# Altium schematic sheet Debug.SchDoc: DEBUG PORT
size A4; SheetNumber: 5; SheetTotal: 5; DOC_NO_SCH_DWG: #022024031004
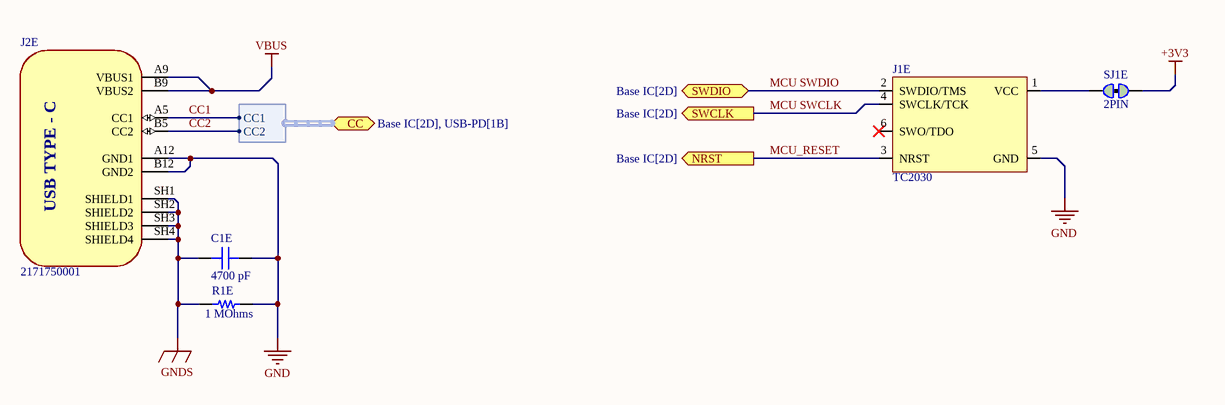
[diagram p0: Debug.SchDoc]

## Parts
C1E  4700 pF  [CAP 0402_1005]
J1E  TC2030  [TC2030-FP]  (no BOM)
J2E  2171750001  [MOLEX_2171750001]
R1E  1 MOhms  [RES 0402_1005]
SJ1E  2PIN  [Rounded Jumper Joint]

## Ports
CC (bidir, harness CC, see Base IC[2D], USB-PD[1B]), NRST (out, see Base IC[2D]), SWCLK (out, see Base IC[2D]), SWDIO (bidir, see Base IC[2D])

## Harnesses
CC: CC1, CC2

## Nets
+3V3: SJ1E.2
GND: C1E.2 J1E.5(GND) J2E.A12(GND1) J2E.B12(GND2) R1E.2
GNDS: C1E.1 J2E.SH1(SHIELD1) J2E.SH2(SHIELD2) J2E.SH3(SHIELD3) J2E.SH4(SHIELD4) R1E.1
VBUS: J2E.A9(VBUS1) J2E.B9(VBUS2)
CC1: J2E.A5(CC1) ; port CC.CC1
CC2: J2E.B5(CC2) ; port CC.CC2
MCU SWCLK: J1E.4(SWCLK/TCK) ; port SWCLK
MCU SWDIO: J1E.2(SWDIO/TMS) ; port SWDIO
MCU_RESET: J1E.3(NRST) ; port NRST
NetJ1E_1: J1E.1(VCC) SJ1E.1

Not connected (* = marked no-connect by the designer): J1E 6(SWO/TDO)*

## Notes on the sheet
- THIS DOCUMENT AND THE DATA DISCLOSED HEREIN OR
- HEREWITH IS THE PROPERTY OF SPD Ind.
- ENG:
- DHARAGESWARAN S
- APPROVALS
- DATE
- PROJECT
- DSN:
- CHK:
- REFERENCE DOCUMENTS
- PROJECT REVISION:
- TITLE
- DOCUMENT REVISION:
- Email: sdhamuvkl@gmail.com <https://github.com/DhamuVkl>
- BOM:
- FAB DWG:
- PCB DWG:
- ASSY DWG:
- SCALE:
- A4
- SIZE
- CAGE CODE
- FILE NAME
- DWG NO.
- SHEET
- REV
- OF
- (in symbol 2171750001) USB TYPE - C

## Library data of the parts
C1E = C0402C472K4RECAUTO: CAP CER 0402 4.7NF 16V X7R 10%; Manufacturer: KEMET; id: 3032; Part Number: C0402C472K4RECAUTO; Value: 4700 pF; Temperature Coefficient: X7R; Supplier Part Number 1: 399-17875-1-ND; ComponentLink2Description: DigiKey Link; ComponentLink1URL: https://api.kemet.com/component-edge/download/datasheet/C0402C472K4RECAUTO.pdf; PartId: 12122; Tolerance: ±10%; Supplier 1: DigiKey; Series: ESD SMD Auto X7R; LastUpdated: 2023-01-03T20:03:46.940; Part Status: Active; Capacitance: 4700 pF; Device Package: 0402 (1005 Metric); Ratings: AEC-Q200; Thickness (Max): 0.022" (0.55mm); Voltage - Rated: 16V; Minimum Order: 1; Packaging: TapeAndReel; Applications: Automotive, ESD Protection; Package / Case: 0402 (1005 Metric); ComponentLink1Description: Datasheet; Price: 0.01; ComponentLink2URL: https://www.digikey.com/en/products/detail/kemet/C0402C472K4RECAUTO/8640469; Lifecycle Status: Active; Operating Temperature: -55°C ~ 125°C; Size / Dimension: 0.039" L x 0.020" W (1.00mm x 0.50mm); Mounting Type: Surface Mount, MLCC
J1E = TC2030: Tag-Connect No-Solder SWD Debug Connector DO NOT PLACE; Manufacturer: Tag-Connect; Manufacturer Part Number: TC2030; Supplier 1: Digikey; Supplier Part Number 1: TC2030-MCP-NLTC-ND
J2E = 2171750001: USB-C (USB TYPE-C) USB 2.0 Receptacle Connector 24 (6+18 Dummy) Position Surface Mount, Right Angle; Through Hole; MF: Molex; SnapEDA_Link: https://www.snapeda.com/parts/2171750001/Molex/view-part/?ref=snap; Package: None; Value: *; MP: 2171750001; Check_prices: https://www.snapeda.com/parts/2171750001/Molex/view-part/?ref=eda
R1E = AC0402FR-071ML: RES SMD 1M OHM 1% 1/16W 0402; Manufacturer: Yageo; id: 4991; Temperature Coefficient: ±100ppm/°C; Power (Watts): 0.063W, 1/16W; Part Number: AC0402FR-071ML; Height - Seated (Max): 0.015" (0.37mm); Supplier Part Number 1: YAG3450CT-ND; Supplier Device Package: 0402; ComponentLink1Description: Datasheet; ComponentLink2URL: https://www.digikey.com/en/products/detail/yageo/AC0402FR-071ML/5895164; Features: Automotive AEC-Q200, Moisture Resistant; ComponentLink1URL: https://www.yageo.com/upload/media/product/productsearch/datasheet/rchip/PYu-AC_51_RoHS_L_7.pdf; Composition: Thick Film; Tolerance: ±1%; Supplier 1: DigiKey; Series: AC; Part Status: Active; ComponentLink2Description: DigiKey Link; Device Package: 0402 (1005 Metric); Packaging: CutTape; Ratings: AEC-Q200; Minimum Order: 1; Package / Case: 0402 (1005 Metric); PartId: 12043; Lifecycle Status: Active; LastUpdated: 2023-01-02T20:21:09.883; Operating Temperature: -55°C ~ 155°C; Number Of Terminations: 2; Value: 1 MOhms; Size / Dimension: 0.039" L x 0.020" W (1.00mm x 0.50mm); Price: 0.01; Resistance: 1 MOhms
SJ1E = Rounded Jumper Joint